# EAGLE schematic motherboard (EAGLE 9.6.2)
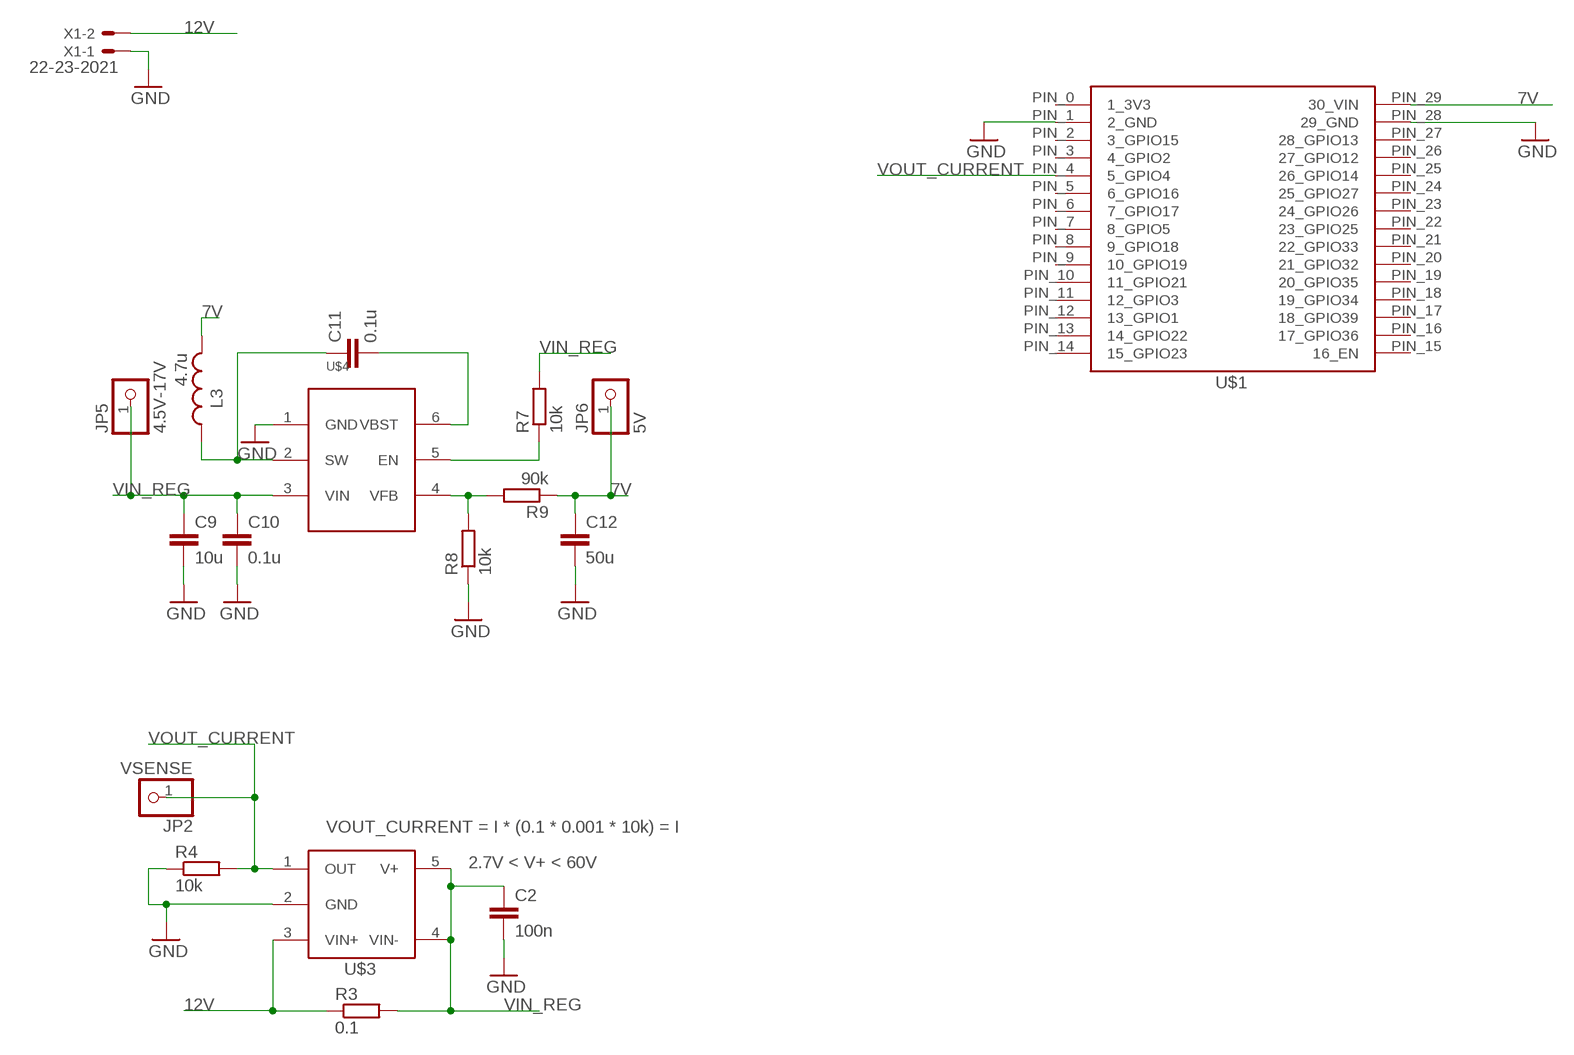
[diagram p0: schematic, sheet 1]

## Parts
C2  100n  C-EUC0805  [C0805]
C9  10u  C-EUC0805  [C0805]
C10  0.1u  C-EUC0805  [C0805]
C11  0.1u  C-EUC0805  [C0805]
C12  50u  C-EUC0805  [C0805]
JP2  VSENSE  PINHD-1X1  [1X01]
JP5  4.5V-17V  PINHD-1X1  [1X01]
JP6  5V  PINHD-1X1  [1X01]
L3  4.7u  L-USL3225M  [L3225M]
R3  0.1  R-EU_R1206  [R1206]
R4  10k  R-EU_R0805  [R0805]
R7  10k  R-EU_R0805  [R0805]
R8  10k  R-EU_R0805  [R0805]
R9  90k  R-EU_R0805  [R0805]
U$1  ESP32_DEVKIT_V1  [ESP32_DEVKIT_V1]
U$3  INA169  [SOT23_5_PIN]
U$4  TPS561201  [SOT23_6_PIN]
X1  22-23-2021  [22-23-2021]

## Nets
7V: C12.1 JP6.1 L3.2 R9.1 U$1.PIN_29(30_VIN)
12V: R3.1 U$3.3(VIN+) X1.2
GND: C2.2 C9.2 C10.2 C12.2 R4.1 R8.1 U$1.PIN_1(2_GND) U$1.PIN_28(29_GND) U$3.2(GND) U$4.1(GND) X1.1
N$9: C11.2 U$4.6(VBST)
N$10: R7.1 U$4.5(EN)
N$11: R8.2 R9.2 U$4.4(VFB)
N$12: C11.1 L3.1 U$4.2(SW)
VIN_REG: C2.1 C9.1 C10.1 JP5.1 R3.2 R7.2 U$3.4(VIN-) U$3.5(V+) U$4.3(VIN)
VOUT_CURRENT: JP2.1 R4.2 U$1.PIN_4(5_GPIO4) U$3.1(OUT)
Unconnected: U$1.PIN_0(1_3V3) U$1.PIN_2(3_GPIO15) U$1.PIN_3(4_GPIO2) U$1.PIN_5(6_GPIO16) U$1.PIN_6(7_GPIO17) U$1.PIN_7(8_GPIO5) U$1.PIN_8(9_GPIO18) U$1.PIN_9(10_GPIO19) U$1.PIN_10(11_GPIO21) U$1.PIN_11(12_GPIO3) U$1.PIN_12(13_GPIO1) U$1.PIN_13(14_GPIO22) U$1.PIN_14(15_GPIO23) U$1.PIN_15(16_EN) U$1.PIN_16(17_GPIO36) U$1.PIN_17(18_GPIO39) U$1.PIN_18(19_GPIO34) U$1.PIN_19(20_GPIO35) U$1.PIN_20(21_GPIO32) U$1.PIN_21(22_GPIO33) U$1.PIN_22(23_GPIO25) U$1.PIN_23(24_GPIO26) U$1.PIN_24(25_GPIO27) U$1.PIN_25(26_GPIO14) U$1.PIN_26(27_GPIO12) U$1.PIN_27(28_GPIO13)

## Notes on the sheet
- VOUT_CURRENT = I * (0.1 * 0.001 * 10k) = I
- 2.7V < V+ < 60V

## Library data of the parts
C2 C9-C12 = rcl:C-EU: CAPACITOR, European symbol; SPICEPREFIX: C
JP2 JP5 JP6 = pinhead:PINHD-1X1: PIN HEADER
L3 = rcl:L-US: INDUCTOR, American symbol; SPICEPREFIX: L
R3 R4 R7-R9 = rcl:R-EU_: RESISTOR, European symbol; SPICEPREFIX: R
U$1 = bzd:ESP32_DEVKIT_V1
U$3 = bzd:INA169
U$4 = bzd:TPS561201
X1 = con-molex:22-23-2021: .100" (2.54mm) Center Header - 2 Pin; MF: MOLEX; MPN: 22-23-2021; OC_FARNELL: 1462926; OC_NEWARK: 25C3832